# Altium schematic sheet DAC.SchDoc: DAC
size A4; Author: Anderson, Jorge; CompanyName: LEICI - FI-UNLP; Revision: 1.1; SheetNumber: 5; SheetTotal: 5; Time: 0; ProjectName: Placa adaptadora TMS320F28335
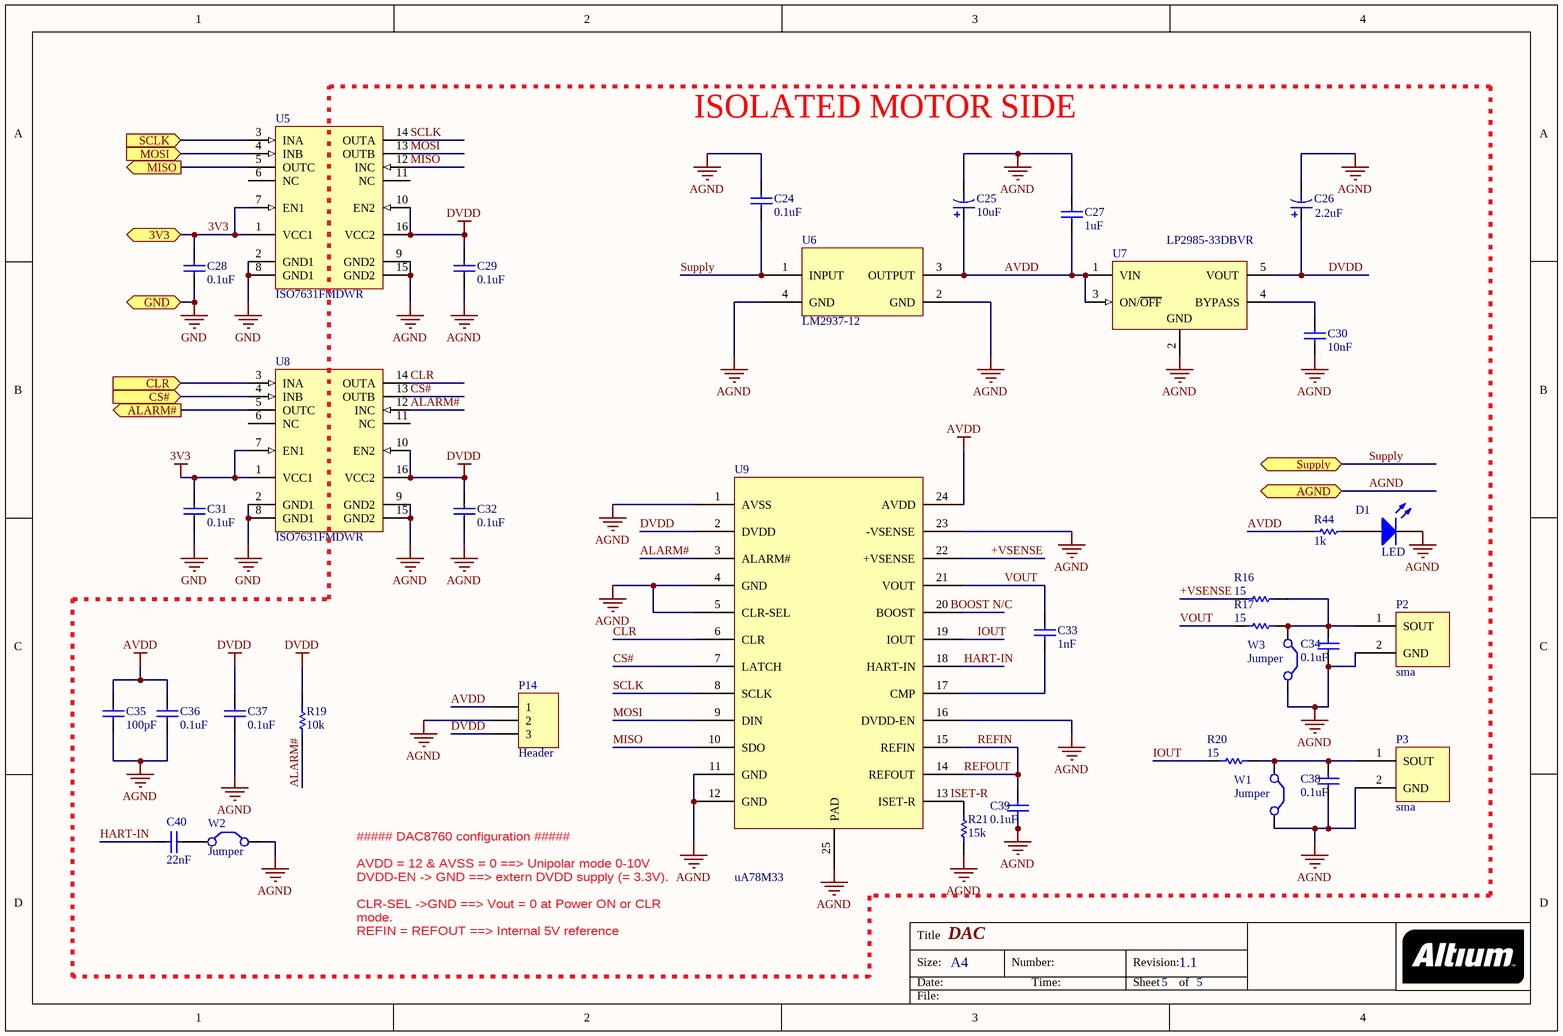
[diagram p0: DAC.SchDoc]

## Parts
C24  value 0.1uF  [C 1206]  (hidden comment: C0.1u)
C25  value 10uF  [Almn cap]  (hidden comment: C10u)
C26  value 2.2uF  [Tantalum]  (hidden comment: CT2.2u)
C27  value 1uF  [0805]  (hidden comment: C1u)
C28  value 0.1uF  [C 1206]  (hidden comment: C0.1u)
C29  value 0.1uF  [C 1206]  (hidden comment: C0.1u)
C30  value 10nF  [C 1206]  (hidden comment: C10n)
C31  value 0.1uF  [C 1206]  (hidden comment: C0.1u)
C32  value 0.1uF  [C 1206]  (hidden comment: C0.1u)
C33  value 1nF  [C 1206]  (hidden comment: C1n)
C34  value 0.1uF  [C 1206]  (hidden comment: C0.1u)
C35  value 100pF  [C 1206]  (hidden comment: C100p)
C36  value 0.1uF  [C 1206]  (hidden comment: C0.1u)
C37  value 0.1uF  [C 1206]  (hidden comment: C0.1uF)
C38  value 0.1uF  [C 1206]  (hidden comment: C0.1u)
C39  value 0.1uF  [C 1206]  (hidden comment: C0.1u)
C40  value 22nF  [C 1206]  (hidden comment: C22n)
D1  LED  [LED-1]
P2  sma  [sma]
P3  sma  [sma]
P14  Header  [HDR1X3]
R16  value 15  [R 1206]  (hidden comment: R15)
R17  value 15  [R 1206]  (hidden comment: R15)
R19  value 10k  [R 1206]  (hidden comment: R10k)
R20  value 15  [R 1206]  (hidden comment: R15)
R21  value 15k  [R 1206]  (hidden comment: R15k)
R44  value 1k  [R 1206]  (hidden comment: R15k)
U5  ISO7631FMDWR  [DW0016A_N]
U6  LM2937-12  [DCY4]
U7  LP2985-33DBVR  [TI-DBV5_N]
U8  ISO7631FMDWR  [DW0016A_N]
U9  uA78M33  [PWP]
W1  Jumper  [Jumper]
W2  Jumper  [Jumper]
W3  Jumper  [Jumper]

## Blocks framed on the sheet
ISOLATED MOTOR SIDE: C24-C27 C29 C30 C32-C40 D1 P2 P3 P14 R16 R17 R19-R21 R44 U5-U9 W1-W3

## Ports
3V3, AGND, ALARM# (out), CLR (in), CS# (in), GND, MISO (out), MOSI (in), SCLK (in), Supply

## Nets
3V3: C28.1 C31.1 U5.1(VCC1) U5.7(EN1) U8.1(VCC1) U8.7(EN1) ; port 3V3
AGND: C24.1 C25.2 C26.2 C27.1 C29.2 C30.2 C32.2 C34.2 C35.2 C36.2 C37.2 C38.2 C39.2 D1.2(K) P2.2(GND) P3.2(GND) P14.2 R21.2 U5.9(GND2) U5.15(GND2) U6.2(GND) U6.4(GND) U7.2(GND) U8.9(GND2) U8.15(GND2) U9.1(AVSS) U9.4(GND) U9.5(CLR-SEL) U9.11(GND) U9.12(GND) U9.16(DVDD-EN) U9.23(-VSENSE) U9.25(PAD) W1.2(C2) W2.2(C2) W3.2(C2) ; port AGND
AVDD: C25.1 C27.2 C35.1 C36.1 P14.1 R44.2 U6.3(OUTPUT) U7.1(VIN) U7.3(ON/~{OFF}) U9.24(AVDD)
DVDD: C26.1 C29.1 C32.1 C37.1 P14.3 R19.1 U5.10(EN2) U5.16(VCC2) U7.5(VOUT) U8.10(EN2) U8.16(VCC2) U9.2(DVDD)
GND: C28.2 C31.2 U5.2(GND1) U5.8(GND1) U8.2(GND1) U8.8(GND1) ; port GND
+VSENSE: R16.2 U9.22(+VSENSE)
ALARM#: R19.2 U8.12(INC) U9.3(ALARM#)
ALARM#: U8.5(OUTC) ; port ALARM#  [a separate net that carries the same name]
CLR: U8.14(OUTA) U9.6(CLR)
CLR: U8.3(INA) ; port CLR  [a separate net that carries the same name]
CS#: U8.13(OUTB) U9.7(LATCH)
CS#: U8.4(INB) ; port CS#  [a separate net that carries the same name]
HART-IN: C40.1 U9.18(HART-IN)
IOUT: R20.2 U9.19(IOUT)
MISO: U5.12(INC) U9.10(SDO)
MISO: U5.5(OUTC) ; port MISO  [a separate net that carries the same name]
MOSI: U5.13(OUTB) U9.9(DIN)
MOSI: U5.4(INB) ; port MOSI  [a separate net that carries the same name]
REFIN: C39.1 U9.14(REFOUT) U9.15(REFIN)  [also labelled REFOUT]
SCLK: U5.14(OUTA) U9.8(SCLK)
SCLK: U5.3(INA) ; port SCLK  [a separate net that carries the same name]
Supply: C24.2 U6.1(INPUT) ; port Supply
VOUT: C33.1 R17.2 U9.21(VOUT)
NetC30_1: C30.1 U7.4(BYPASS)
NetC33_2: C33.2 U9.17(CMP)
NetC34_1: C34.1 P2.1(SOUT) R16.1 R17.1 W3.1(C1)
NetC38_1: C38.1 P3.1(SOUT) R20.1 W1.1(C1)
NetC40_2: C40.2 W2.1(C1)
NetD1_1: D1.1(A) R44.1
NetR21_1: R21.1 U9.13(ISET-R)

Not connected (* = marked no-connect by the designer): U5 6(NC) 11(NC); U8 6(NC) 11(NC); U9 20(BOOST)

## Notes on the sheet
- ##### DAC8760 configuration #####
  AVDD = 12 & AVSS = 0 ==> Unipolar mode 0-10V
  DVDD-EN -> GND ==> extern DVDD supply (= 3.3V).
  CLR-SEL ->GND ==> Vout = 0 at Power ON or CLR mode.
  REFIN = REFOUT ==> Internal 5V reference
- Labels drawn without touching a wire or pin: BOOST N/C, ISET-R
- Title
- Size:
- Date:
- A4
- Number:
- Time:
- Revision:
- Sheet
- of
- File:

## Library data of the parts
C24 C27-C40 = C: Capacitor; .PCBCheck: Used; .Creator: SR; .SCHCheck: Used; Category: Capacitores
C25 = Capacitor pol: Capacitor polarzado
C26 = C Tantalum: Tantalum capacitor
D1 = LED1: Typical RED GaAs LED; Published: 8-Jun-2000; LatestRevisionDate: 08-Jul-2005; LatestRevisionNote: Mech Layer 1 removed.; PackageReference: LED-1; Publisher: Altium Limited; PackageDescription: LED; 2 Leads
P14 = Header 3: Header, 3-Pin; LatestRevisionDate: 17-Jul-2002; LatestRevisionNote: Re-released for DXP Platform.; Publisher: Altium Limited
R16 R17 R19-R21 R44 = R: Resistencia; .Creator: SR; .PCBCheck: Used; .SCHCheck: Used; Category: Resistencias
U5 U8 = ISO7641FMDWR: 150 Mbps 6 kVpk Low Power Quad Channels, Digital Isolator, 2.7 V / 3.3 V / 5 V, -40 to +125 degC, 16-pin SOIC (DW), Green (RoHS & no Sb/Br); Manufacturer: Texas Instruments; Datarate(Mbps): 150; Input Noise Filter: None; Insulation Rating(VRMS): 5000; Prop Delay(Max)(ns): 10.5; Rating: Catalog; Supply Voltage(s)(V): 2.7, 3.3, 5; TTL/CMOS Input Threshold: TTL; DatasheetVersion: SLLSE89C; PackageVersion: 4040000-2/G, 01/2011; PackageReference: DW0016A; PackageDescription: 16-Pin Plastic Small Outline, Body 10.30 x 7.50 mm, Pitch 1.27 mm; Supplier 1: Digi-Key; Supplier Part Number 1: 296-35966-2-ND; Supplier 2: Digi-Key; Supplier Part Number 2: 296-35966-1-ND; Supplier 3: Digi-Key; Supplier Part Number 3: 296-35966-6-ND; Supplier 4: Newark; Supplier Part Number 4: 70T7542; Supplier 5: Mouser; Supplier Part Number 5: 595-ISO7641FMDWR; Eco-Plan: Green (RoHS & no Sb/Br); Fail Safe: Low; SubFamily: Isolator; Thermal Shutdown: No; MountType: SMT; Code_JEDEC: MS-013; PartNumber: ISO7641FMDWR; ComponentLink1Description: Manufacturer URL; ComponentLink1URL: http://www.ti.com/; ComponentLink2Description: Datasheet; ComponentLink2URL: http://www.ti.com/general/docs/lit/getliterature.tsp?genericPartNumber=ISO7641FM&fileType=pdf; ComponentLink3Description: Package Specification; ComponentLink3URL: http://www.ti.com/litv/pdf/msoi003g; ComponentLink4Description: SamplesURL; ComponentLink4URL: http://www.ti.com/product/iso7641fm#samples
U6 = LM2937: Supplier 1: Newark; Supplier 2: Newark; Supplier Part Number 2: 41K4556
U7 = LP2985-10DBVR: Single Output Low Noise LDO, 150 mA, Fixed 3.3 V Output, 2.2 to 16 V Input, with Low IQ, 5-pin SOT-23 (DBV), -40 to 125 degC, Green (RoHS & no Sb/Br); Manufacturer: Texas Instruments; Accuracy(%): 1.5; Fixed Output Options(V): 3.3; Iout(Max)(A): 0.15; Iq(Typ)(mA): 0.85; SubFamily: Single Channel LDO; Vdo(Typ)(mV): 280; Vin(Max)(V): 16; Vin(Min)(V): 2.2; DatasheetVersion: SLVS522N; PackageVersion: 4073253-4/K; PackageReference: DBV5; PackageDescription: 5-Pin Plastic Small Outline, Body 1.60 Ã— 2.90 mm, Pitch 0.95 mm; Eco-Plan: Green (RoHS & no Sb/Br); Vout Adj(Max)(V): 3.3; Vout Adj(Min)(V): 3.3; Mounting Technology: Surface Mount; Code_JEDEC: MO-178; PartNumber: LP2985-33DBVR; ComponentLink1Description: Manufacturer URL; ComponentLink1URL: http://www.ti.com/; ComponentLink2Description: Datasheet; ComponentLink2URL: http://www.ti.com/general/docs/lit/getliterature.tsp?genericPartNumber=LP2985-10&fileType=pdf; ComponentLink3Description: Package Specification; ComponentLink3URL: http://www.ti.com/litv/pdf/mpds018i; Supplier 1: Farnell; Supplier Part Number 1: 2412118; Supplier 2: Digi-Key; Supplier Part Number 2: 296-18476-6-ND
U9 = DAC8760
W1-W3 = Jumper: Jumper Wire; Published: 24-Mar-1999; LatestRevisionDate: 17-Jul-2002; LatestRevisionNote: Re-released for DXP Platform.; PackageReference: RAD-0.2; Publisher: Altium Limited; PackageDescription: Radial Cap, Thru-Hole; 2 Leads; 0.2 in Pin Spacing
P2 P3 = sma: Supplier 1: Newark; Supplier 2: Newark; Supplier Part Number 2: 90F2624